# Altium schematic sheet LED´s_Pedal.SchDoc
size A4
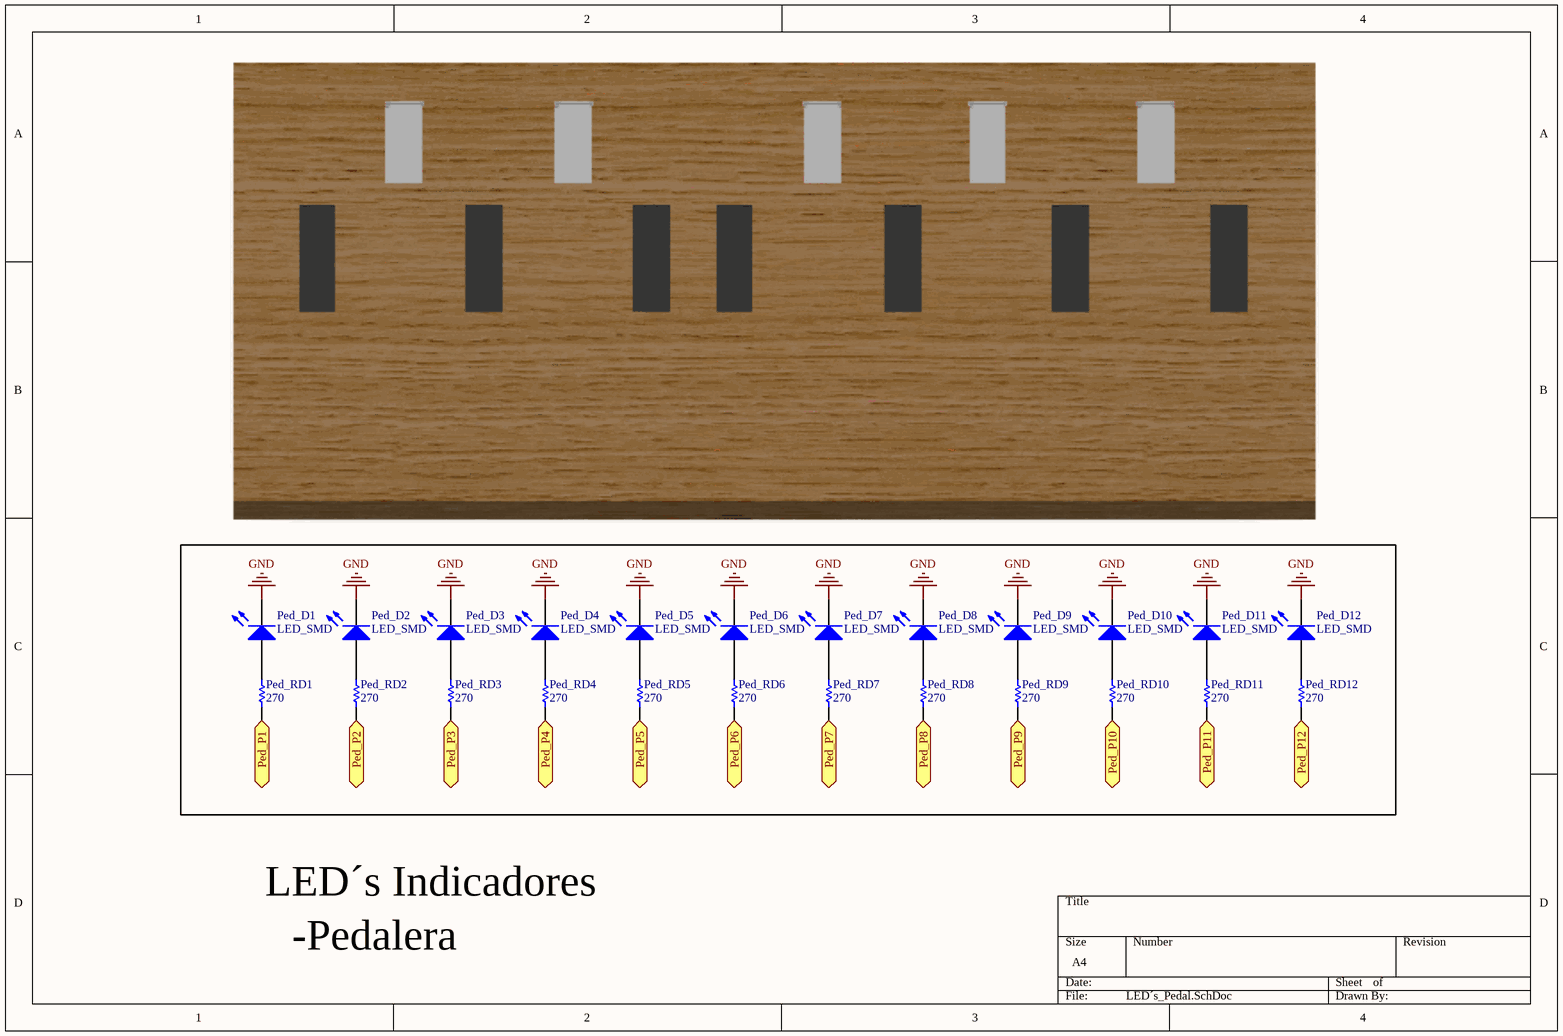
[diagram p0: LED´s_Pedal.SchDoc]

## Parts
Ped_D1  LED_SMD  [0805]
Ped_D2  LED_SMD  [0805]
Ped_D3  LED_SMD  [0805]
Ped_D4  LED_SMD  [0805]
Ped_D5  LED_SMD  [0805]
Ped_D6  LED_SMD  [0805]
Ped_D7  LED_SMD  [0805]
Ped_D8  LED_SMD  [0805]
Ped_D9  LED_SMD  [0805]
Ped_D10  LED_SMD  [0805]
Ped_D11  LED_SMD  [0805]
Ped_D12  LED_SMD  [0805]
Ped_RD1  value 270  [0805 Chip Res]  (hidden comment: Res Chip 0805)
Ped_RD2  value 270  [0805 Chip Res]  (hidden comment: Res Chip 0805)
Ped_RD3  value 270  [0805 Chip Res]  (hidden comment: Res Chip 0805)
Ped_RD4  value 270  [0805 Chip Res]  (hidden comment: Res Chip 0805)
Ped_RD5  value 270  [0805 Chip Res]  (hidden comment: Res Chip 0805)
Ped_RD6  value 270  [0805 Chip Res]  (hidden comment: Res Chip 0805)
Ped_RD7  value 270  [0805 Chip Res]  (hidden comment: Res Chip 0805)
Ped_RD8  value 270  [0805 Chip Res]  (hidden comment: Res Chip 0805)
Ped_RD9  value 270  [0805 Chip Res]  (hidden comment: Res Chip 0805)
Ped_RD10  value 270  [0805 Chip Res]  (hidden comment: Res Chip 0805)
Ped_RD11  value 270  [0805 Chip Res]  (hidden comment: Res Chip 0805)
Ped_RD12  value 270  [0805 Chip Res]  (hidden comment: Res Chip 0805)

## Ports
Ped_P1, Ped_P2, Ped_P3, Ped_P4, Ped_P5, Ped_P6, Ped_P7, Ped_P8, Ped_P9, Ped_P10, Ped_P11, Ped_P12

## Nets
GND: Ped_D1.2(K) Ped_D2.2(K) Ped_D3.2(K) Ped_D4.2(K) Ped_D5.2(K) Ped_D6.2(K) Ped_D7.2(K) Ped_D8.2(K) Ped_D9.2(K) Ped_D10.2(K) Ped_D11.2(K) Ped_D12.2(K)
Ped_P1: Ped_RD1.1 ; port Ped_P1
Ped_P2: Ped_RD2.1 ; port Ped_P2
Ped_P3: Ped_RD3.1 ; port Ped_P3
Ped_P4: Ped_RD4.1 ; port Ped_P4
Ped_P5: Ped_RD5.1 ; port Ped_P5
Ped_P6: Ped_RD6.1 ; port Ped_P6
Ped_P7: Ped_RD7.1 ; port Ped_P7
Ped_P8: Ped_RD8.1 ; port Ped_P8
Ped_P9: Ped_RD9.1 ; port Ped_P9
Ped_P10: Ped_RD10.1 ; port Ped_P10
Ped_P11: Ped_RD11.1 ; port Ped_P11
Ped_P12: Ped_RD12.1 ; port Ped_P12
NetPed_D1_1: Ped_D1.1(A) Ped_RD1.2
NetPed_D2_1: Ped_D2.1(A) Ped_RD2.2
NetPed_D3_1: Ped_D3.1(A) Ped_RD3.2
NetPed_D4_1: Ped_D4.1(A) Ped_RD4.2
NetPed_D5_1: Ped_D5.1(A) Ped_RD5.2
NetPed_D6_1: Ped_D6.1(A) Ped_RD6.2
NetPed_D7_1: Ped_D7.1(A) Ped_RD7.2
NetPed_D8_1: Ped_D8.1(A) Ped_RD8.2
NetPed_D9_1: Ped_D9.1(A) Ped_RD9.2
NetPed_D10_1: Ped_D10.1(A) Ped_RD10.2
NetPed_D11_1: Ped_D11.1(A) Ped_RD11.2
NetPed_D12_1: Ped_D12.1(A) Ped_RD12.2

## Notes on the sheet
- LED´s Indicadores
- -Pedalera

## Library data of the parts
Ped_D1-Ped_D12 = LED_SMD: LED SMD; Published: 8-Jun-2000; LatestRevisionDate: 08-Jul-2005; LatestRevisionNote: Mech Layer 1 removed.; PackageReference: LED-0; Publisher: Altium Limited
Ped_RD1-Ped_RD12 = Resistencia: Published: 8-Jun-2000; LatestRevisionDate: 17-Jul-2002; LatestRevisionNote: Re-released for DXP Platform.; PackageReference: AXIAL-0.3; Publisher: Altium Limited; PackageDescription: Axial Device, Thru-Hole; 2 Leads; 0.3 in Pin Spacing